# Altium schematic sheet Power.SchDoc: OnTrack Power
size A3; Date: 2022-06; DrawnBy: Simon Björklund; Engineer: Simon Björklund; Organization: ETA; Revision: 3; SheetNumber: 3; SheetTotal: 6
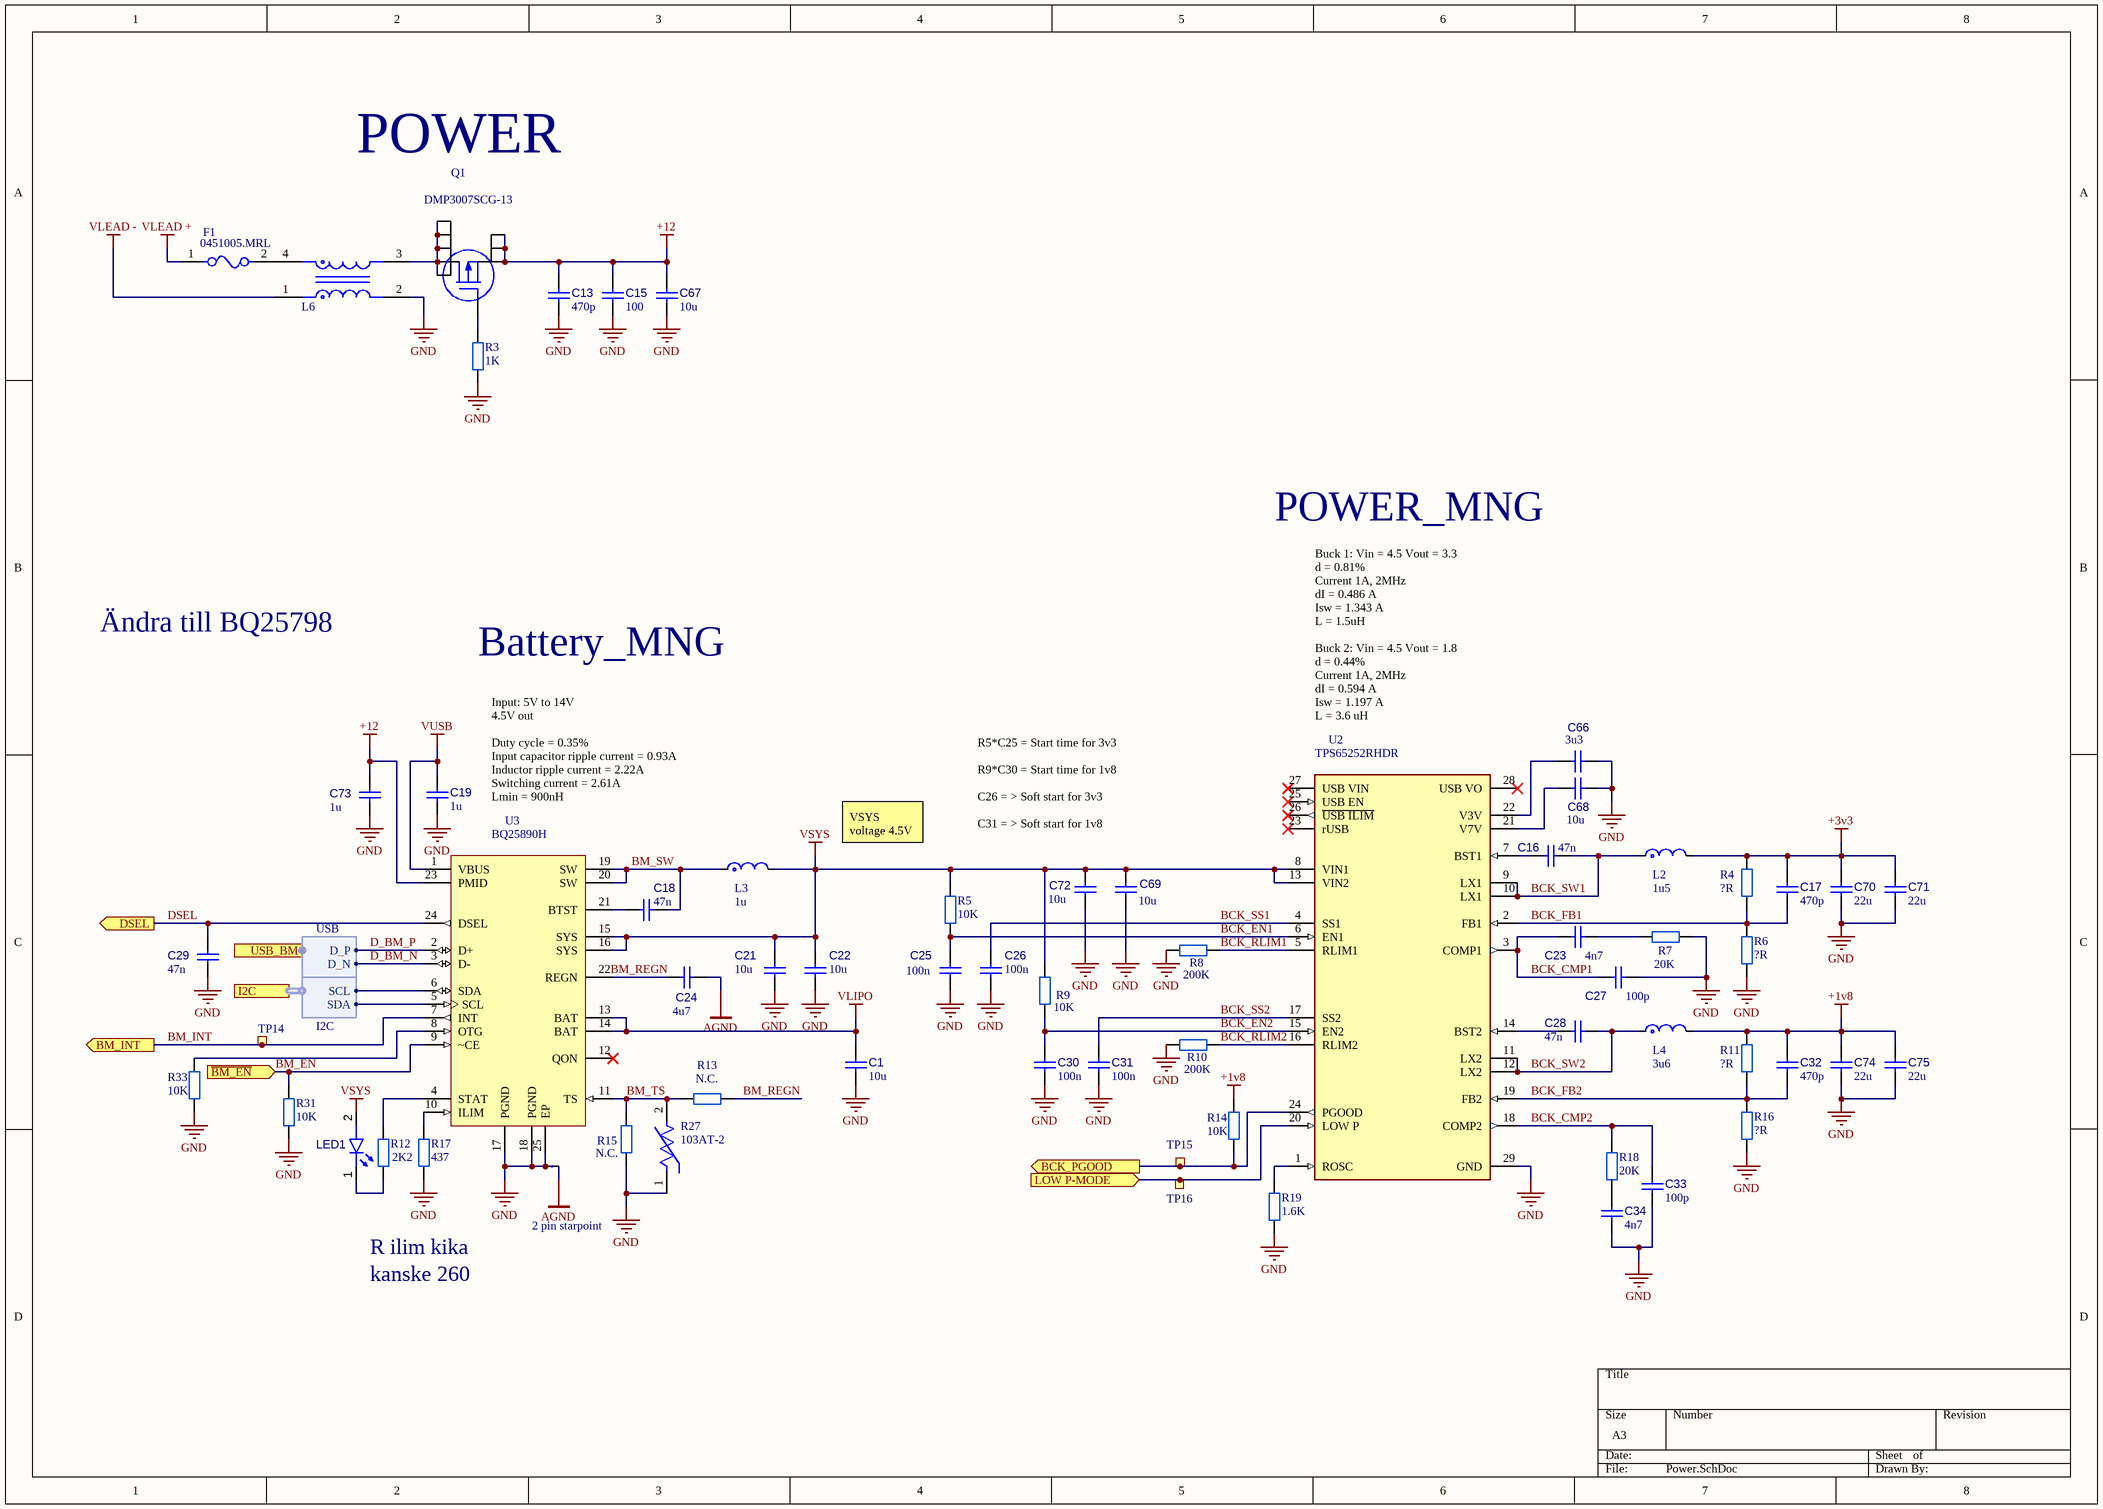
[diagram p0: Power.SchDoc]

## Parts
C1  value 10u  [CAPC1608X90X40LL10T20 HD]  (hidden comment: Capacitor 0603)
C13  value 470p  [CAPC2013X95X50LL10T25 HD]  (hidden comment: Capacitor 0805)
C15  value 100  [CAPC1608X90X40LL10T20 HD]  (hidden comment: Capacitor 0603)
C16  value 47n  [CAPC1005X55X25LL05T10 HD]  (hidden comment: Capacitor 0402)
C17  value 470p  [CAPC1005X55X25LL05T10 HD]  (hidden comment: Capacitor 0402)
C18  value 47n  [CAPC1005X55X25LL05T10 HD]  (hidden comment: Capacitor 0402)
C19  value 1u  [CAPC1005X55X25LL05T10 HD]  (hidden comment: Capacitor 0402)
C21  value 10u  [CAPC1608X90X40LL10T20 HD]  (hidden comment: Capacitor 0603)
C22  value 10u  [CAPC1608X90X40LL10T20 HD]  (hidden comment: Capacitor 0603)
C23  value 4n7  [CAPC1005X55X25LL05T10 HD]  (hidden comment: Capacitor 0402)
C24  value 4u7  [CAPC1608X90X40LL10T20 HD]  (hidden comment: Capacitor 0603)
C25  value 100n  [CAPC1005X55X25LL05T10 HD]  (hidden comment: Capacitor 0402)
C26  value 100n  [CAPC1005X55X25LL05T10 HD]  (hidden comment: Capacitor 0402)
C27  value 100p  [CAPC1005X55X25LL05T10 HD]  (hidden comment: Capacitor 0402)
C28  value 47n  [CAPC1005X55X25LL05T10 HD]  (hidden comment: Capacitor 0402)
C29  value 47n  [CAPC1005X55X25LL05T10 HD]  (hidden comment: Capacitor 0402)
C30  value 100n  [CAPC1005X55X25LL05T10 HD]  (hidden comment: Capacitor 0402)
C31  value 100n  [CAPC1005X55X25LL05T10 HD]  (hidden comment: Capacitor 0402)
C32  value 470p  [CAPC1005X55X25LL05T10 HD]  (hidden comment: Capacitor 0402)
C33  value 100p  [CAPC1005X55X25LL05T10 HD]  (hidden comment: Capacitor 0402)
C34  value 4n7  [CAPC1005X55X25LL05T10 HD]  (hidden comment: Capacitor 0402)
C66  value 3u3  [CAPC1608X90X40LL10T20 HD]  (hidden comment: Capacitor 0603)
C67  value 10u  [CAPC1608X90X40LL10T20 HD]  (hidden comment: Capacitor 0603)
C68  value 10u  [CAPC1608X90X40LL10T20 HD]  (hidden comment: Capacitor 0603)
C69  value 10u  [CAPC1608X90X40LL10T20 HD]  (hidden comment: Capacitor 0603)
C70  value 22u  [CAPC1608X90X40LL10T20 HD]  (hidden comment: Capacitor 0603)
C71  value 22u  [CAPC1608X90X40LL10T20 HD]  (hidden comment: Capacitor 0603)
C72  value 10u  [CAPC1608X90X40LL10T20 HD]  (hidden comment: Capacitor 0603)
C73  value 1u  [CAPC1005X55X25LL05T10 HD]  (hidden comment: Capacitor 0402)
C74  value 22u  [CAPC1608X90X40LL10T20 HD]  (hidden comment: Capacitor 0603)
C75  value 22u  [CAPC1608X90X40LL10T20 HD]  (hidden comment: Capacitor 0603)
F1  0451005.MRL  [FP-0451-MFG]
L2  value 1u5  [INDC2013X105X50NL20T20]  (hidden comment: Inductor 0805)
L3  Inductance: 1u  [INDC2013X105X50NL20T20]  (hidden comment: Inductor 0805)
L4  value 3u6  [INDC2013X105X50NL20T20]  (hidden comment: Inductor 0805)
L6  DLW5ATN231TQ2L  [FP-DLW5A-MFG]  (value not drawn)
LED1  QBLP595-R  [QTB-QBLP595_V]  (value not drawn)
Q1  DMP3007SCG-13  [DMP3007SCG13]
R3  value 1K  [RESC1005X40X25LL10T10 HD]  (hidden comment: Resistor 0403)
R4  value ?R  [RESC1005X40X25LL10T10 HD]  (hidden comment: Resistor 0403)
R5  value 10K  [RESC1005X40X25LL10T10 HD]  (hidden comment: Resistor 0403)
R6  value ?R  [RESC1005X40X25LL10T10 HD]  (hidden comment: Resistor 0403)
R7  value 20K  [RESC1005X40X25LL10T10 HD]  (hidden comment: Resistor 0403)
R8  value 200K  [RESC1005X40X25LL10T10 HD]  (hidden comment: Resistor 0403)
R9  value 10K  [RESC1005X40X25LL10T10 HD]  (hidden comment: Resistor 0403)
R10  value 200K  [RESC1005X40X25LL10T10 HD]  (hidden comment: Resistor 0403)
R11  value ?R  [RESC1005X40X25LL10T10 HD]  (hidden comment: Resistor 0403)
R12  value 2K2  [RESC1005X40X25LL10T10 HD]  (hidden comment: Resistor 0403)
R13  value N.C.  [RESC1005X40X25LL10T10 HD]  (hidden comment: Resistor 0403)
R14  value 10K  [RESC1005X40X25LL10T10 HD]  (hidden comment: Resistor 0403)
R15  value N.C.  [RESC1005X40X25LL10T10 HD]  (hidden comment: Resistor 0403)
R16  value ?R  [RESC1005X40X25LL10T10 HD]  (hidden comment: Resistor 0403)
R17  value 437  [RESC1005X40X25LL10T10 HD]  (hidden comment: Resistor 0403)
R18  value 20K  [RESC1005X40X25LL10T10 HD]  (hidden comment: Resistor 0403)
R19  value 1.6K  [RESC1005X40X25LL10T10 HD]  (hidden comment: Resistor 0403)
R27  103AT-2  [FP-103AT-2-MFG]
R31  value 10K  [RESC1005X40X25LL10T10 HD]  (hidden comment: Resistor 0403)
R33  value 10K  [RESC1005X40X25LL10T10 HD]  (hidden comment: Resistor 0403)
ST1  2 pin starpoint  [2 PIN STARPOINT]  (net tie, no BOM)
TP14  TP_SMD_Ø0.7MM  [TP_SMD_Ø0.7mm]  (value not drawn)  (no BOM)
TP15  TP_SMD_Ø0.7MM  [TP_SMD_Ø0.7mm]  (value not drawn)  (no BOM)
TP16  TP_SMD_Ø0.7MM  [TP_SMD_Ø0.7mm]  (value not drawn)  (no BOM)
U2  TPS65252RHDR  [FP-RHD0028A-MFG]
U3  BQ25890H  [QFN50P400X400X80-25N-D]

## Ports
BCK_PGOOD (out), BM_INT (out), DSEL (out), I2C (harness I2C), LOW P-MODE (in), USB_BM (harness USB), ~{BM_EN} (in)

## Harnesses
I2C: SCL, SDA
USB: D_P, D_N

## Nets
+1v8: C32.2 C74.2 C75.2 L4.2 R11.2 R14.2
+3v3: C17.2 C70.2 C71.2 L2.2 R4.2
+12: C13.2 C15.2 C67.2 C73.2 Q1.1(S) Q1.2(S) Q1.3(S) U3.23(PMID)
AGND: C24.2 ST1.2
GND: C1.1 C13.1 C15.1 C19.1 C21.1 C22.1 C25.1 C26.1 C27.1 C29.1 C30.1 C31.1 C33.1 C34.1 C66.1 C67.1 C68.1 C69.1 C70.1 C71.1 C72.1 C73.1 C74.1 C75.1 L6.2 R3.1 R6.1 R7.2 R8.1 R10.1 R15.1 R16.1 R17.1 R19.1 R27.1 R31.1 R33.1 ST1.1 U2.29(GND) U3.17(PGND) U3.18(PGND) U3.25(EP)
VLEAD +: F1.1
VLEAD -: L6.1
VLIPO: C1.2 U3.13(BAT) U3.14(BAT)
VSYS: C21.2 C22.2 C69.2 C72.2 L3.2 LED1.2(A) R5.2 R9.2 U2.8(VIN1) U2.13(VIN2) U3.15(SYS) U3.16(SYS)
VUSB: C19.2 U3.1(VBUS)
BCK_CMP1: C23.1 C27.2 U2.3(COMP1)
BCK_CMP2: C33.2 R18.2 U2.18(COMP2)
BCK_EN1: C25.2 R5.1 U2.6(EN1)
BCK_EN2: C30.2 R9.1 U2.15(EN2)
BCK_FB1: C17.1 R4.1 R6.2 U2.2(FB1)
BCK_FB2: C32.1 R11.1 R16.2 U2.19(FB2)
BCK_PGOOD: R14.1 TP15.1 U2.24(PGOOD) ; port BCK_PGOOD
BCK_RLIM1: R8.2 U2.5(RLIM1)
BCK_RLIM2: R10.2 U2.16(RLIM2)
BCK_SS1: C26.2 U2.4(SS1)
BCK_SS2: C31.2 U2.17(SS2)
BCK_SW1: C16.2 L2.1 U2.9(LX1) U2.10(LX1)
BCK_SW2: C28.2 L4.1 U2.11(LX2) U2.12(LX2)
BM_~{EN}: R31.2 U3.9(~CE) ; port ~{BM_EN}
BM_INT: TP14.1 U3.7(INT) ; port BM_INT
BM_REGN: C24.1 R13.2 U3.22(REGN)
BM_SW: C18.2 L3.1 U3.19(SW) U3.20(SW)
BM_TS: R13.1 R15.2 R27.2 U3.11(TS)
D_BM_N: U3.3(D-) ; port USB_BM.D_N
D_BM_P: U3.2(D+) ; port USB_BM.D_P
DSEL: C29.2 U3.24(DSEL) ; port DSEL
LOW P-MODE: TP16.1 U2.20(LOW_P) ; port LOW P-MODE
NetC16_1: C16.1 U2.7(BST1)
NetC18_1: C18.1 U3.21(BTST)
NetC23_2: C23.2 R7.1
NetC28_1: C28.1 U2.14(BST2)
NetC34_2: C34.2 R18.1
NetC66_2: C66.2 U2.22(V3V)
NetC68_2: C68.2 U2.21(V7V)
NetF1_2: F1.2 L6.4
NetL6_3: L6.3 Q1.5(D) Q1.6(D) Q1.7(D) Q1.8(D) Q1.9(D)
NetLED1_1: LED1.1(K) R12.2
NetQ1_4: Q1.4(G) R3.2
NetR12_1: R12.1 U3.4(STAT)
NetR17_2: R17.2 U3.10(ILIM)
NetR19_2: R19.2 U2.1(ROSC)
NetR33_2: R33.2 U3.8(OTG)
NetU3_5: U3.5(SCL) ; port I2C.SDA
NetU3_6: U3.6(SDA) ; port I2C.SCL

Not connected (* = marked no-connect by the designer): U2 23(rUSB)* 25(USB_EN)* 26(~{USB_ILIM})* 27(USB_VIN)* 28(USB_VO)*; U3 12(QON)*

## Notes on the sheet
- POWER
- POWER_MNG
- Ändra till BQ25798
- Buck 1: Vin = 4.5 Vout = 3.3
  d = 0.81%
  Current 1A, 2MHz
  dI = 0.486 A
  Isw = 1.343 A
  L = 1.5uH
- Battery_MNG
- Buck 2: Vin = 4.5 Vout = 1.8
  d = 0.44%
  Current 1A, 2MHz
  dI = 0.594 A
  Isw = 1.197 A
  L = 3.6 uH
- Input: 5V to 14V
  4.5V out
  Duty cycle = 0.35%
  Input capacitor ripple current = 0.93A
  Inductor ripple current = 2.22A
  Switching current = 2.61A
  Lmin = 900nH
- VSYS voltage 4.5V
- R5*C25 = Start time for 3v3
  R9*C30 = Start time for 1v8
  C26 = > Soft start for 3v3
  C31 = > Soft start for 1v8
- R ilim kika
- kanske 260

## Library data of the parts
C1 C15 C21 C22 C24 C66-C72 C74 C75 = CMP-001-00014-13: Chip Capacitor, 0603 (1608 Metric); Voltage Rating: ?V; Tolerance: ?%; Max Operating Temperature: Ceramic; Pins: 2; Case/Package: 0603; Mounting Technology: SMT
C13 = CMP-001-00018-14: Chip Capacitor, 0805 (2012 Metric); Voltage Rating: ?V; Capacitor Type: Ceramic; Tolerance: ?%; Pins: 2; Min Operating Temperature: -55°C; Case/Package: 0805; Mounting Technology: SMT; Max Operating Temperature: 125°C
C16-C18 C23 C27 C28 C32-C34 = CMP-001-00008-14: Chip Capacitor, 0402 (1005 Metric); Capacitor Type: Ceramic; Tolerance: ?%; Voltage Rating: ?V; Pins: 2; Mounting Technology: SMT; Case/Package: 0402
C19 C25 C26 C29-C31 C73 = CMP-001-00008-14: Chip Capacitor, 0402 (1005 Metric); Tolerance: ?%; Capacitor Type: Ceramic; Voltage Rating: ?V; Case/Package: 0402; Pins: 2; Mounting Technology: SMT
F1 = CMP-2000-05653-2: FUSE BRD MNT 5A 125VAC/VDC 2SMD; Manufacturer: Littelfuse Inc; Fuse Blow Speed: Fast; Voltage Rating: 125V; Fuse Interrupt Ac Current: 50A; Value: 0.0125Ω; Fuse I2T: 5.566A2Sec; Device Class L3: unset; Temperature Range Low: -55°C; Height: 2.94mm; Category: Fuse; Fuse Current: 5A; Octopart: https://octopart.com/0451005.mrl-littelfuse-566389; Package: 0451; RoHS: TRUE; Manufacturer Part Number: 0451005.MRL; Mouser Description: Surface Mount Fuses 125V 5A; Device Class L2: Fuses; ComponentLink2URL: https://www.littelfuse.com/~/media/electronics/datasheets/fuses/littelfuse_fuse_451_453_datasheet.pdf.pdf; Temperature Range High: +125°C; Digikey Description: FUSE BRD MNT 5A 125VAC/VDC 2SMD; Device Class L1: Circuit Protection; Automotive: No; Fuse Interrupt Dc Current: 50A; Temperature: -55°C to +125°C; Max Fuse Dc Voltage: 125V; Resistance: 0.0125Ω; ComponentLink2Description: Datasheet; Max Fuse Ac Voltage: 125V; Lead Free: Yes
L2 L4 = CMP-006-00023-4: Inductor RF Chip Thin Film 0805; Current Rating: ?A; Resonant Frequency: ?Hz; Pins: 2
  L2: Inductance: 1u5
  L4: Inductance: 3u6
L3 = CMP-006-00023-4: Inductor RF Chip Thin Film 0805; Current Rating: ?A; Resonant Frequency: ?Hz; Value: ?H; Pins: 2
L6 = CMP-000010-1: Ind Common Mode Choke Wirewound 230 Ohm 100MHz 4A Embossed T/R
LED1 = CMP-007-00040-3: Chip LED 0402, Red, 0.02 A, 2.0 to 2.5 V, -40 to 80 degC, 2-Pin SMD, RoHS, Tape and Reel; Colour: Red; RoHS Compliant: Yes; Case/Package: 0402; Pins: 2; Mounting Technology: SMT
Q1 = CMP-028-000000-2: Trans MOSFET P-CH 30V 50A 8-Pin VDFN EP T/R; Manufacturer_Name: Diodes Inc.; Source: Moto Symbol Lib.SchLib; Height: 0.85mm; Mouser Price/Stock: https://www.mouser.co.uk/ProductDetail/Diodes-Incorporated/DMP3007SCG-13?qs=lqAf%2FiVYw9j1j9A9Mlh%252Bjg%3D%3D; Design Item ID: DMP3007SCG-13; Manufacturer_Part_Number: DMP3007SCG-13; Arrow Price/Stock: https://www.arrow.com/en/products/dmp3007scg-13/diodes-incorporated; Arrow Part Number: DMP3007SCG-13; Mouser Part Number: 621-DMP3007SCG-13; Datasheet Link: https://componentsearchengine.com/Datasheets/1/DMP3007SCG-13.pdf
R3-R19 R31 R33 = CMP-009-00178-4: Package: 0403; Design Item ID: Resistor EU; Source: Moto Symbol Lib.SchLib
R27 = CMP-2000-05824-2: Thermistor NTC 10KOhm 1% 2-Pin; Resistance: 10kR; Lead Pitch: 2.54mm; Height: 2.4mm; Max Operating Temperature: 110°C; Width: 3.7mm; RoHS Compliant: Yes; Min Operating Temperature: -50°C; Termination: Radial; Packaging: Bulk; Number of Pins: 2; Series: AT; Tolerance: 1%; Length: 17mm
ST1 = CMP-026-000001-1: Starpoint; Note: N.A.; Pad Count: 2; Value: N.A.; PartId: 100500603; Source: pca20035.SCHLIB; Design Item ID: 2 pin starpoint; Published: 2017-08-31; HelpURL: N.A.; Manufacturer Part Number: N.A.; Part number IPS: N.A.; Component Type: Net Tie; Component Class: Connectors; ComponentLink1Description: Datasheet; Footprint Doc: N.A.; ComponentLink1URL: N.A.; Manufacturer: N.A.; ComponentLink2Description: Supplier link; Pin Count: 2; ComponentLink2URL: N.A.; LatestRevisionDate: 2017-08-31; Part Number: 2 pin starpoint; Artikkelnr Noca: N.A.
TP14-TP16 = CMP-025-000000-1: 0.7mm circular SMD testpad; Manufacturer: Nordic Semiconductor; Artikkelnr Noca: N.A.; Value: Ø0.7mm,SMD; Pad Count: 1; ComponentLink1Description: Datasheet; Component Class: Connectors; Part Number: TP_SMD_Ø0.7MM; HelpURL: N.A.; Source: pca20035.SCHLIB; Published: 2017-12-14; ComponentLink1URL: N.A.; Note: N.A.; Pin Count: 1; Component Type: Standard (No BOM); Design Item ID: TP_SMD_Ø0.7MM; Part number IPS: N.A.; PartId: 100500474; LatestRevisionDate: 2017-12-14; Manufacturer Part Number: N.A.; ComponentLink2URL: N.A.; ComponentLink2Description: Supplier link; Footprint Doc: TP_SMD_Ø0.7mm
U2 = CMP-019-00049-6: TPS65252 4.5V to 16V Input, 3A/2
U3 = CMP-010-000003-3: BQ25890H I2C Controlled Single Cell 5-A Fast Charger with MaxChargeTM Technology for High Input Voltage and Adjustable Voltage USB On-the-Go Boost Mode; Design Item ID: BQ25890H; Source: Moto Symbol Lib.SchLib